# EAGLE schematic Scheme (EAGLE 6.5.0)
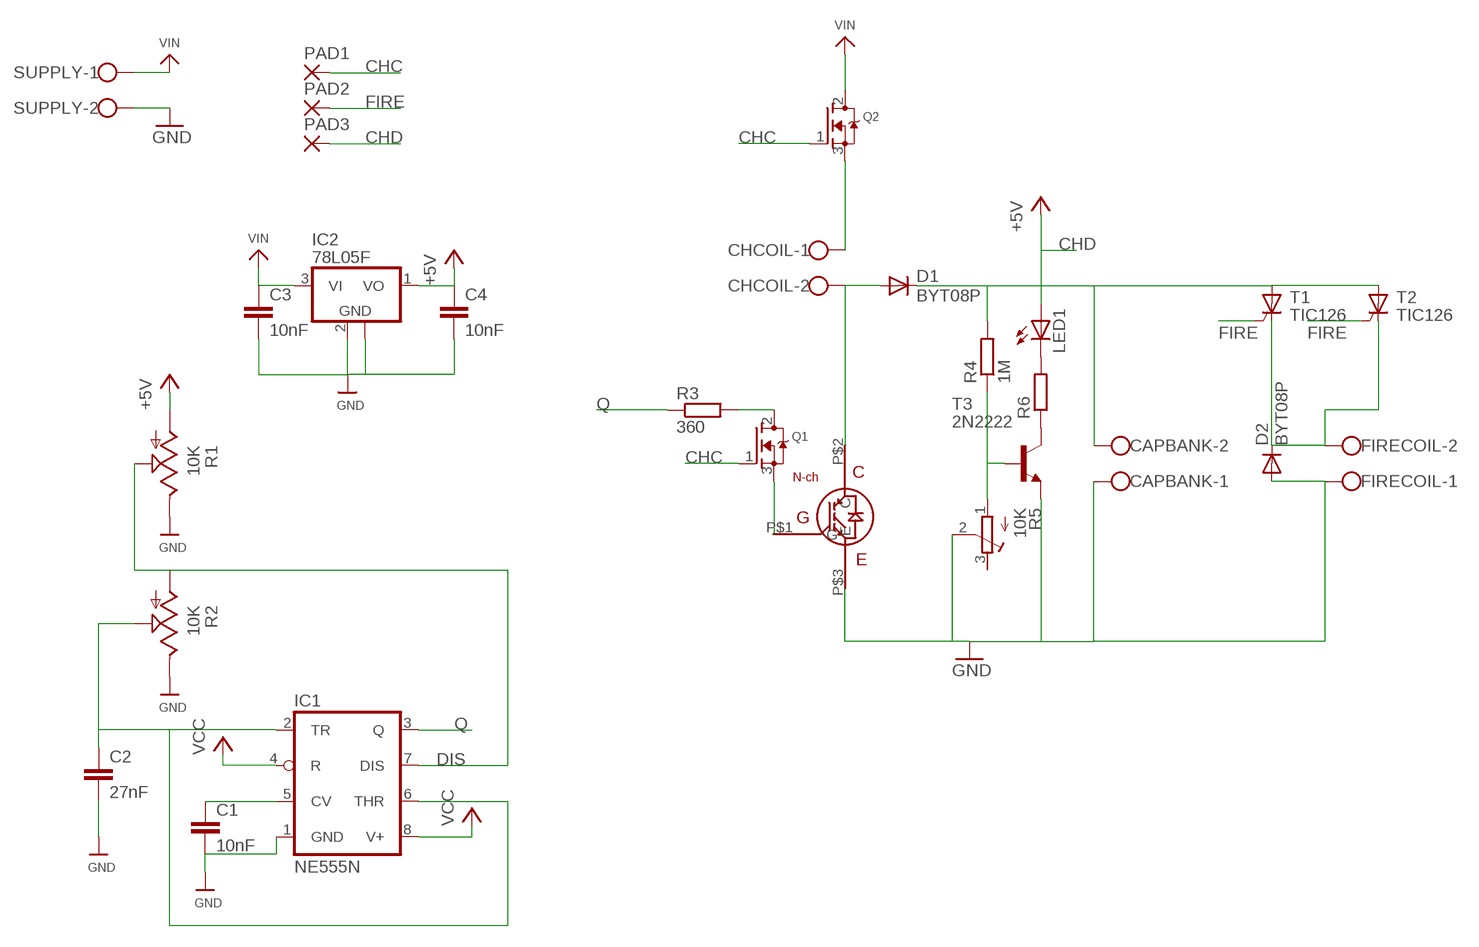
[diagram p0: schematic, sheet 1]

## Parts
C1  10nF  C-EU025-024X044  [C025-024X044]
C2  27nF  C-EU025-024X044  [C025-024X044]
C3  10nF  C-EU025-024X044  [C025-024X044]
C4  10nF  C-EU025-024X044  [C025-024X044]
CAPBANK  W237-102  [W237-102]
CHCOIL  W237-102  [W237-102]
D1  BYT08P  [TO220ACS]
D2  BYT08P  [TO220ACS]
FIRECOIL  W237-102  [W237-102]
IC1  NE555N  [DIL08-ROUND]
IC2  78L05F  [SOT89]
LED1  LED3MM  [LED3MM]
PAD1  1,6/0,9  [1,6/0,9]
PAD2  1,6/0,9  [1,6/0,9]
PAD3  1,6/0,9  [1,6/0,9]
Q1  MOSFET-NGDS_TO220V  [TO220V]
Q2  MOSFET-NGDS_TO220V  [TO220V]
R1  10K  TRIM  [6MM]
R2  10K  TRIM  [6MM]
R3  360  R-EU_0204/7  [0204/7]
R4  1M  R-EU_0411/15  [0411/15]
R5  10K  R-TRIMM3339P  [RTRIM3339P]
R6  R-EU_R1206  [R1206]
SUPPLY  W237-102  [W237-102]
T1  TIC126  [TO220CS]
T2  TIC126  [TO220CS]
T3  2N2222  [TO92-EBC-OVAL]
U$5  TO-247A  [TO-247]

## Nets
+5V: C4.1 IC2.1(VO) R1.A
CHC: PAD1.1(P) Q1.1(G) Q2.1(G)
CHD: LED1.A PAD3.1(P) ; supply symbol labelled +5V
DIS: IC1.7(DIS) R1.S R2.A
FIRE: PAD2.1(P) T1.G T2.G
GND: C1.2 C2.2 C3.2 C4.2 CAPBANK.1 D2.A FIRECOIL.1 IC1.1(GND) IC2.2(GND) IC2.2@1(GND) R1.E R2.E R5.2(S) SUPPLY.2 T3.E U$5.P$3(E)
N$1: Q1.2(D) R3.2
N$2: C1.1 IC1.5(CV)
N$3: CHCOIL.1 Q2.3(S)
N$4: CHCOIL.2 D1.A U$5.P$2(C)
N$5: Q1.3(S) U$5.P$1(G)
N$6: CAPBANK.2 D1.C R4.2 T1.A T2.A
N$7: D2.C FIRECOIL.2 T1.C T2.C
N$8: R4.1 R5.1(A) T3.B
N$9: LED1.K(C) R6.2
N$10: R6.1 T3.C
Q: IC1.3(Q) R3.1
THR: C2.1 IC1.2(TR) IC1.6(THR) R2.S
VCC: IC1.4(R) IC1.8(V+)
VIN: C3.1 IC2.3(VI) Q2.2(D) SUPPLY.1
Unconnected: R5.3(E)

## Library data of the parts
C1-C4 = rcl:C-EU: CAPACITOR, European symbol
CAPBANK CHCOIL FIRECOIL SUPPLY = con-wago-500:W237-102: WAGO SCREW CLAMP; MPN: 237-102; OC_FARNELL: unknown; OC_NEWARK: 70K9898
D1 D2 = diode:BYT08P: DIODE ultra fast
IC1 = adafruit:*555: TIMER Changed DIP package to have round (not oval) pin pads http://www.ladyada.net/library/pcb/eaglelibrary.html
IC2 = linear:78L*: POSITOIV-VOLTAGE REGULATORS Output up to 100 mA Source: http://focus.ti.com/lit/ds/symlink/ua78l05.pdf
LED1 = adafruit:LED: LED OSRAM: - CHIPLED LG R971, LG N971, LY N971, LG Q971, LY Q971, LO R971, LY R971 LH N974, LH R974 LS Q976, LO Q976, LY Q976 LO Q996 - Hyper CHIPLED LW Q18S LB Q993, LB Q99A, LB R99A - SideLED LS A670, LO A670, LY A670, LG A670, LP A670 LB A673, LV A673, LT A673, LW A673 LH A674 LY A675 LS A676, LA A676, LO A676, LY A676, LW A676 LS A679, LY A679, LG A679 - Hyper Micro SIDELED® LS Y876, LA Y876, LO Y876, LY Y876 LT Y87S - SmartLED LW L88C, LW L88S LB L89C, LB L89S, LG L890 LS L89K, LO L89K, LY L89K LS L896, LA L896, LO L896, LY L896 - TOPLED LS T670, LO T670, LY T670, LG T670, LP T670 LSG T670, LSP T670, LSY T670, LOP T670, LYG T670 LG T671, LOG T671, LSG T671 LB T673, LV T673, LT T673, LW T673 LH T674 LS T676, LA T676, LO T676, LY T676, LB T676, LH T676, LSB T676, LW T676 LB T67C, LV T67C, LT T67C, LS T67K, LO T67K, LY T67K, LW E67C LS E67B, LA E67B, LO E67B, LY E67B, LB E67C, LV E67C, LT E67C LW T67C LS T679, LY T679, LG T679 LS T770, LO T770, LY T770, LG T770, LP T770 LB T773, LV T773, LT T773, LW T773 LH T774 LS E675, LA E675, LY E675, LS T675 LS T776, LA T776, LO T776, LY T776, LB T776 LHGB T686 LT T68C, LB T68C - Hyper Mini TOPLED® LB M676 - Mini TOPLED Santana® LG M470 LS M47K, LO M47K, LY M47K Source: http://www.osram.convergy.de/
PAD1-PAD3 = wirepad:1,6/0,9: THROUGH-HOLE PAD
Q1 Q2 = adafruit:MOSFET-N: N-Channel Mosfet 2N7002E - 60V 260mA SOT23 [Digikey: 2N7002ET1GOSTR-ND] - REEL BSH103 - 30V 850mA SOT23 [Digikey: 568-5013-1-ND]
R1 R2 = adafruit:TRIM
R3 R4 R6 = rcl:R-EU_: RESISTOR, European symbol
R5 = rcl:R-TRIMM: Trimm resistor
T1 T2 = triac:TIC126: THYRISTOR
T3 = adafruit:2N2222: NPN TRANSISTOR Big oval pads
U$5 = to-247_n-channel_igbt:TO-247